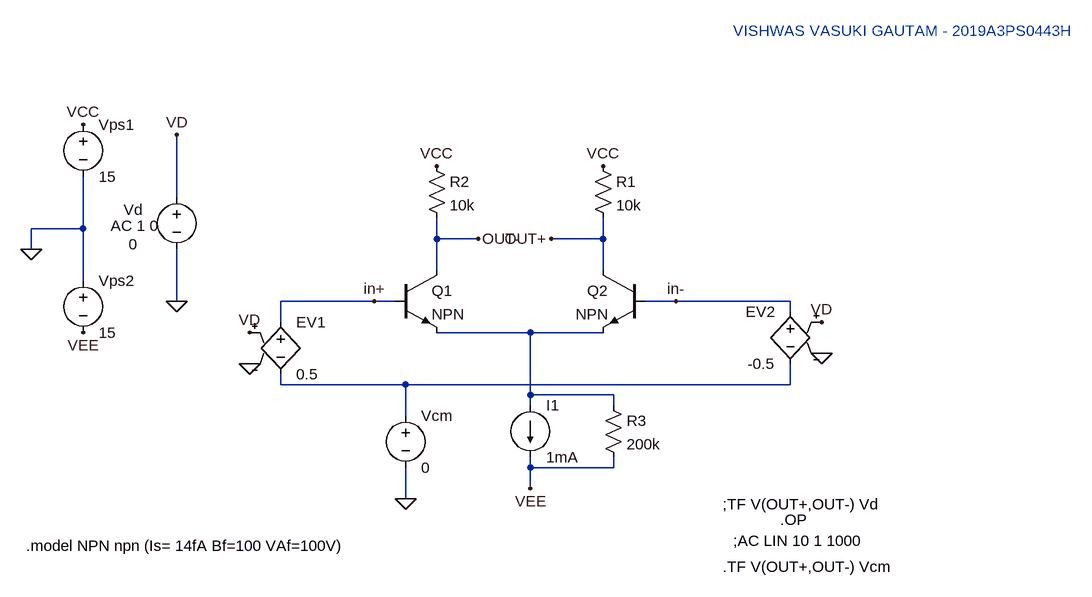
[diagram p0: schematic Lab9.asc]
Lab9.asc, the LTspice schematic file:
Version 4
SHEET 1 880 680
WIRE -1280 -496 -1280 -592
WIRE -1424 -448 -1424 -528
WIRE -1424 -448 -1504 -448
WIRE -880 -432 -880 -464
WIRE -816 -432 -880 -432
WIRE -624 -432 -624 -464
WIRE -624 -432 -704 -432
WIRE -1504 -416 -1504 -448
WIRE -880 -384 -880 -432
WIRE -624 -384 -624 -432
WIRE -1424 -368 -1424 -448
WIRE -1280 -336 -1280 -416
WIRE -976 -336 -1120 -336
WIRE -944 -336 -976 -336
WIRE -512 -336 -560 -336
WIRE -336 -336 -512 -336
WIRE -336 -320 -336 -336
WIRE -1120 -304 -1120 -336
WIRE -736 -288 -880 -288
WIRE -624 -288 -736 -288
WIRE -1120 -208 -1120 -224
WIRE -928 -208 -1120 -208
WIRE -336 -208 -336 -240
WIRE -336 -208 -928 -208
WIRE -736 -192 -736 -288
WIRE -608 -192 -736 -192
WIRE -736 -176 -736 -192
WIRE -608 -176 -608 -192
WIRE -928 -160 -928 -208
WIRE -736 -80 -736 -96
WIRE -608 -80 -608 -96
WIRE -608 -80 -736 -80
WIRE -736 -48 -736 -80
WIRE -928 -32 -928 -80
FLAG -624 -544 VCC
FLAG -880 -544 VCC
FLAG -1424 -608 VCC
FLAG -1424 -288 VEE
FLAG -1504 -416 0
FLAG -1280 -592 VD
FLAG -976 -336 in+
FLAG -288 -256 0
FLAG -1168 -240 0
FLAG -928 -32 0
FLAG -736 -48 VEE
FLAG -288 -304 VD
FLAG -1168 -288 VD
FLAG -704 -432 OUT+
FLAG -816 -432 OUT-
FLAG -1280 -336 0
FLAG -512 -336 in-
SYMBOL res -640 -560 R0
SYMATTR InstName R1
SYMATTR Value 10k
SYMBOL res -896 -560 R0
SYMATTR InstName R2
SYMATTR Value 10k
SYMBOL voltage -1424 -624 R0
WINDOW 123 0 0 Left 2
WINDOW 39 0 0 Left 2
SYMATTR InstName Vps1
SYMATTR Value 15
SYMBOL voltage -1424 -384 R0
WINDOW 123 0 0 Left 2
WINDOW 39 0 0 Left 2
SYMATTR InstName Vps2
SYMATTR Value 15
SYMBOL voltage -1280 -512 R0
WINDOW 123 -102 60 Left 2
WINDOW 39 0 0 Left 2
WINDOW 0 -82 35 Left 2
WINDOW 3 -74 88 Left 2
SYMATTR Value2 AC 1 0
SYMATTR InstName Vd
SYMATTR Value 0
SYMBOL e -1120 -320 R0
SYMATTR InstName EV1
SYMATTR Value 0.5
SYMBOL e -336 -336 M0
SYMATTR InstName EV2
SYMATTR Value -0.5
SYMBOL voltage -928 -176 R0
WINDOW 123 0 0 Left 2
WINDOW 39 0 0 Left 2
SYMATTR InstName Vcm
SYMATTR Value 0
SYMBOL current -736 -176 R0
WINDOW 123 0 0 Left 2
WINDOW 39 0 0 Left 2
SYMATTR InstName I1
SYMATTR Value 1mA
SYMBOL res -624 -192 R0
SYMATTR InstName R3
SYMATTR Value 200k
SYMBOL npn -944 -384 R0
SYMATTR InstName Q1
SYMBOL npn -560 -384 M0
SYMATTR InstName Q2
TEXT -1512 40 Left 2 !.model NPN npn (Is= 14fA Bf=100 VAf=100V)
TEXT -440 -24 Left 2 !;TF V(OUT+,OUT-) Vd
TEXT -352 0 Left 2 !.OP
TEXT -424 32 Left 2 !;AC LIN 10 1 1000
TEXT -440 72 Left 2 !.TF V(OUT+,OUT-) Vcm
TEXT -424 -752 Left 2 ;VISHWAS VASUKI GAUTAM - 2019A3PS0443H

The netlist it stands for:
* Lab9.asc
R1 VCC OUT+ 10k
R2 VCC OUT- 10k
Vps1 VCC 0 15
Vps2 0 VEE 15
Vd VD 0 0 AC 1 0
EV1 in+ N002 VD 0 0.5
EV2 in- N002 VD 0 -0.5
Vcm N002 0 0
I1 N001 VEE 1mA
R3 N001 VEE 200k
Q1 OUT- in+ N001 0 NPN
Q2 OUT+ in- N001 0 NPN
.model NPN NPN
.model PNP PNP
.lib standard.bjt
.model NPN npn (Is= 14fA Bf=100 VAf=100V)
;TF V(OUT+,OUT-) Vd
.OP
;AC LIN 10 1 1000
.TF V(OUT+,OUT-) Vcm
* VISHWAS VASUKI GAUTAM - 2019A3PS0443H
.backanno
.end